# EAGLE design shield_uno (EAGLE 6.5.0)
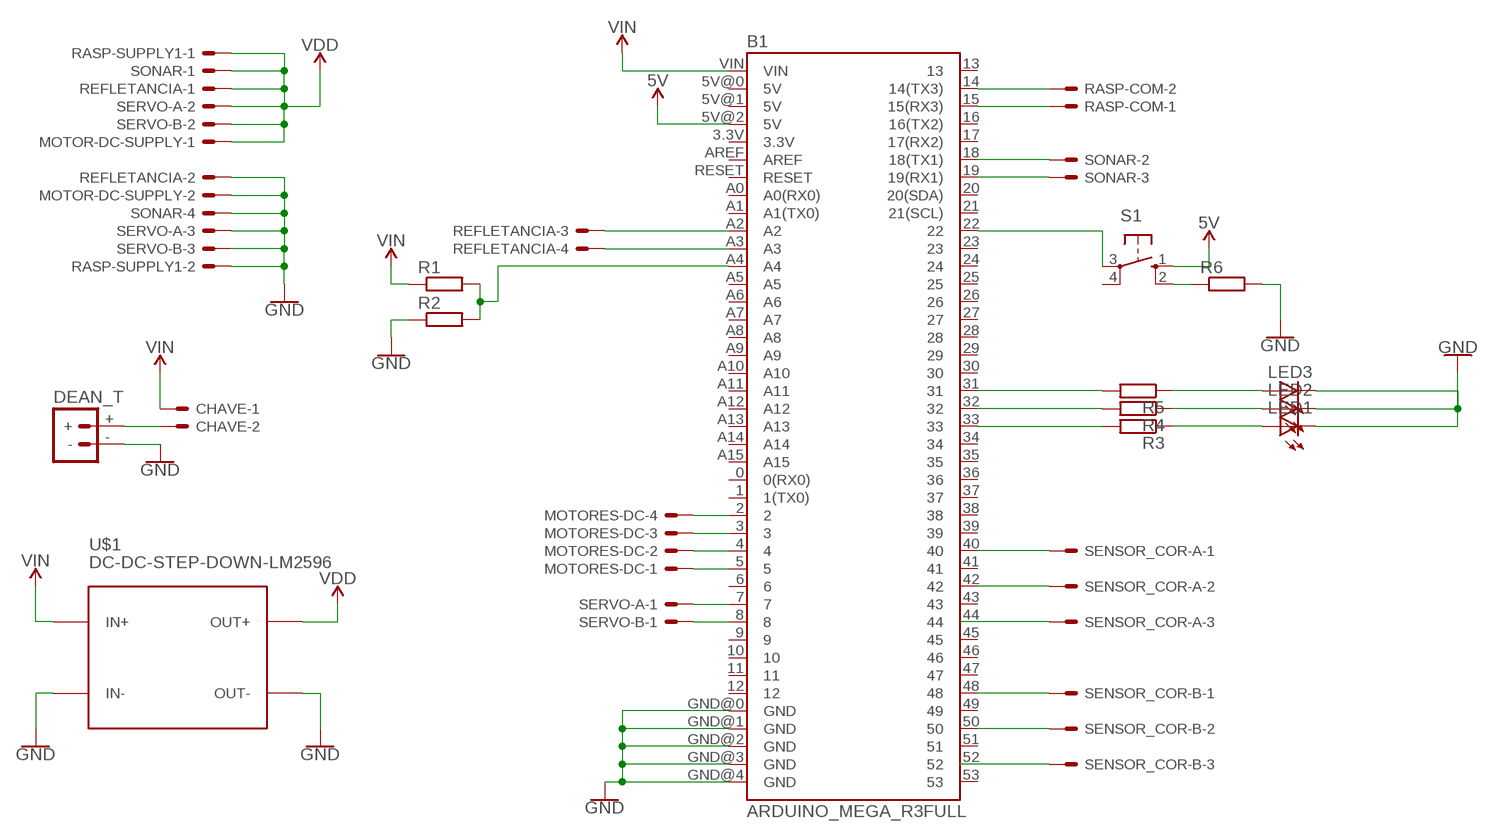
[diagram p0: schematic, sheet 1]

## Parts
B1  ARDUINO_MEGA_R3FULL  [ARDUINO_MEGA]
CHAVE  22-23-2021  [22-23-2021]
DEAN_T  BATTERY_CONN_DEANS  [DEANS]
LED1  LED5MM  [LED5MM]
LED2  LED5MM  [LED5MM]
LED3  LED5MM  [LED5MM]
MOTOR-DC-SUPPLY  22-23-2021  [22-23-2021]
MOTORES-DC  22-23-2041  [22-23-2041]
R1  R-EU_0207/12  [0207/12]
R2  R-EU_0207/12  [0207/12]
R3  R-EU_0207/7  [0207/7]
R4  R-EU_0207/7  [0207/7]
R5  R-EU_0207/7  [0207/7]
R6  R-EU_0204/5  [0204/5]
RASP-COM  22-23-2021  [22-23-2021]
RASP-SUPPLY1  22-23-2021  [22-23-2021]
REFLETANCIA  22-23-2041  [22-23-2041]
S1  10-XX  [B3F-10XX]
SENSOR_COR-A  22-23-2031  [22-23-2031]
SENSOR_COR-B  22-23-2031  [22-23-2031]
SERVO-A  22-23-2031  [22-23-2031]
SERVO-B  22-23-2031  [22-23-2031]
SONAR  22-23-2041  [22-23-2041]
U$1  DC-DC-STEP-DOWN-LM2596  [DC-DC-STEP-DOWN-LM2596]

## Nets
5V: B1.5V@2(5V) S1.1(S)
GND: B1.GND@0(GND) B1.GND@1(GND) B1.GND@2(GND) B1.GND@3(GND) B1.GND@4(GND) DEAN_T.- LED1.K(C) LED2.K(C) LED3.K(C) MOTOR-DC-SUPPLY.2 R2.1 R6.2 RASP-SUPPLY1.2 REFLETANCIA.2 SERVO-A.3 SERVO-B.3 SONAR.4 U$1.IN- U$1.OUT-
N$1: B1.A2 REFLETANCIA.3
N$2: B1.A3 REFLETANCIA.4
N$3: B1.5 MOTORES-DC.1
N$4: B1.4 MOTORES-DC.2
N$5: B1.3 MOTORES-DC.3
N$6: B1.2 MOTORES-DC.4
N$7: B1.8 SERVO-B.1
N$8: B1.7 SERVO-A.1
N$9: B1.14(14(TX3)) RASP-COM.2
N$10: B1.15(15(RX3)) RASP-COM.1
N$11: B1.18(18(TX1)) SONAR.2
N$12: B1.19(19(RX1)) SONAR.3
N$13: CHAVE.2 DEAN_T.+
N$14: B1.40 SENSOR_COR-A.1
N$15: B1.42 SENSOR_COR-A.2
N$16: SENSOR_COR-A.3
N$17: B1.48 SENSOR_COR-B.1
N$18: B1.50 SENSOR_COR-B.2
N$19: SENSOR_COR-B.3
N$20: B1.A4 R1.2 R2.2
N$21: B1.31 R5.2
N$22: B1.32 R4.2
N$23: B1.33 R3.2
N$24: LED1.A R3.1
N$25: LED2.A R4.1
N$26: LED3.A R5.1
N$27: B1.22 S1.3(P)
N$28: R6.1 S1.2(S1)
VDD: MOTOR-DC-SUPPLY.1 RASP-SUPPLY1.1 REFLETANCIA.1 SERVO-A.2 SERVO-B.2 SONAR.1 U$1.OUT+
VIN: B1.VIN CHAVE.1 R1.1 U$1.IN+
Unconnected: B1.0(0(RX0)) B1.1(1(TX0)) B1.3.3V B1.5V@0(5V) B1.5V@1(5V) B1.6 B1.9 B1.10 B1.11 B1.12 B1.13 B1.16(16(TX2)) B1.17(17(RX2)) B1.20(20(SDA)) B1.21(21(SCL)) B1.23 B1.24 B1.25 B1.26 B1.27 B1.28 B1.29 B1.30 B1.34 B1.35 B1.36 B1.37 B1.38 B1.39 B1.41 B1.43 B1.44 B1.45 B1.46 B1.47 B1.49 B1.51 B1.52 B1.53 B1.A0(A0(RX0)) B1.A1(A1(TX0)) B1.A5 B1.A6 B1.A7 B1.A8 B1.A9 B1.A10 B1.A11 B1.A12 B1.A13 B1.A14 B1.A15 B1.AREF B1.RESET S1.4(P1)

## Library data of the parts
B1 = SparkFun-Boards2:ARDUINO_MEGA_R3: Arduino Mega R3 ATmega2560 R3 compatible footprint. SparkFun Products: Arduino Mega 2560 R3 <https://www.sparkfun.com/products/11061>
CHAVE MOTOR-DC-SUPPLY RASP-COM RASP-SUPPLY1 = con-molex:22-23-2021: .100" (2.54mm) Center Header - 2 Pin; MF: MOLEX; MPN: 22-23-2021; OC_FARNELL: 1462926; OC_NEWARK: 25C3832
DEAN_T = SparkFun-Connectors:BATTERY_CONN: Battery Connectors Various footprints for battery connections SparkFun Products: Deans Connector -M/F Pair <https://www.sparkfun.com/products/11864>; SF_ID: PRT-11864
LED1-LED3 = led:LED: LED OSRAM: - CHIPLED LG R971, LG N971, LY N971, LG Q971, LY Q971, LO R971, LY R971 LH N974, LH R974 LS Q976, LO Q976, LY Q976 LO Q996 - Hyper CHIPLED LW Q18S LB Q993, LB Q99A, LB R99A - SideLED LS A670, LO A670, LY A670, LG A670, LP A670 LB A673, LV A673, LT A673, LW A673 LH A674 LY A675 LS A676, LA A676, LO A676, LY A676, LW A676 LS A679, LY A679, LG A679 - Hyper Micro SIDELED® LS Y876, LA Y876, LO Y876, LY Y876 LT Y87S - SmartLED LW L88C, LW L88S LB L89C, LB L89S, LG L890 LS L89K, LO L89K, LY L89K LS L896, LA L896, LO L896, LY L896 - TOPLED LS T670, LO T670, LY T670, LG T670, LP T670 LSG T670, LSP T670, LSY T670, LOP T670, LYG T670 LG T671, LOG T671, LSG T671 LB T673, LV T673, LT T673, LW T673 LH T674 LS T676, LA T676, LO T676, LY T676, LB T676, LH T676, LSB T676, LW T676 LB T67C, LV T67C, LT T67C, LS T67K, LO T67K, LY T67K, LW E67C LS E67B, LA E67B, LO E67B, LY E67B, LB E67C, LV E67C, LT E67C LW T67C LS T679, LY T679, LG T679 LS T770, LO T770, LY T770, LG T770, LP T770 LB T773, LV T773, LT T773, LW T773 LH T774 LS E675, LA E675, LY E675, LS T675 LS T776, LA T776, LO T776, LY T776, LB T776 LHGB T686 LT T68C, LB T68C - Hyper Mini TOPLED® LB M676 - Mini TOPLED Santana® LG M470 LS M47K, LO M47K, LY M47K Source: http://www.osram.convergy.de LUXEON: - LUMILED® LXK2-PW12-R00, LXK2-PW12-S00, LXK2-PW14-U00, LXK2-PW14-V00 LXK2-PM12-R00, LXK2-PM12-S00, LXK2-PM14-U00 LXK2-PE12-Q00, LXK2-PE12-R00, LXK2-PE12-S00, LXK2-PE14-T00, LXK2-PE14-U00 LXK2-PB12-K00, LXK2-PB12-L00, LXK2-PB12-M00, LXK2-PB14-N00, LXK2-PB14-P00, LXK2-PB14-Q00 LXK2-PR12-L00, LXK2-PR12-M00, LXK2-PR14-Q00, LXK2-PR14-R00 LXK2-PD12-Q00, LXK2-PD12-R00, LXK2-PD12-S00 LXK2-PH12-R00, LXK2-PH12-S00 LXK2-PL12-P00, LXK2-PL12-Q00, LXK2-PL12-R00 Source: www.luxeon.com KINGBRIGHT: KA-3528ASYC Source: www.kingbright.com
MOTORES-DC REFLETANCIA SONAR = con-molex:22-23-2041: .100" (2.54mm) Center Header - 4 Pin; MF: MOLEX; MPN: 22-23-2041; OC_FARNELL: 1462920; OC_NEWARK: 38C0355
R1-R6 = rcl:R-EU_: RESISTOR, European symbol
S1 = switch-omron:10-XX: OMRON SWITCH; MPN: B3F-1000; OC_FARNELL: 176432; OC_NEWARK: 36M3542
SENSOR_COR-A SENSOR_COR-B SERVO-A SERVO-B = con-molex:22-23-2031: .100" (2.54mm) Center Header - 3 Pin; MF: MOLEX; MPN: 22-23-2031; OC_FARNELL: 1462950; OC_NEWARK: 30C0862
U$1 = 1484249208697-powermodules:DC-DC-STEP-DOWN-LM2596: DC/DC Step-Down Regulator based on LM2596-ADJ chip

## Board
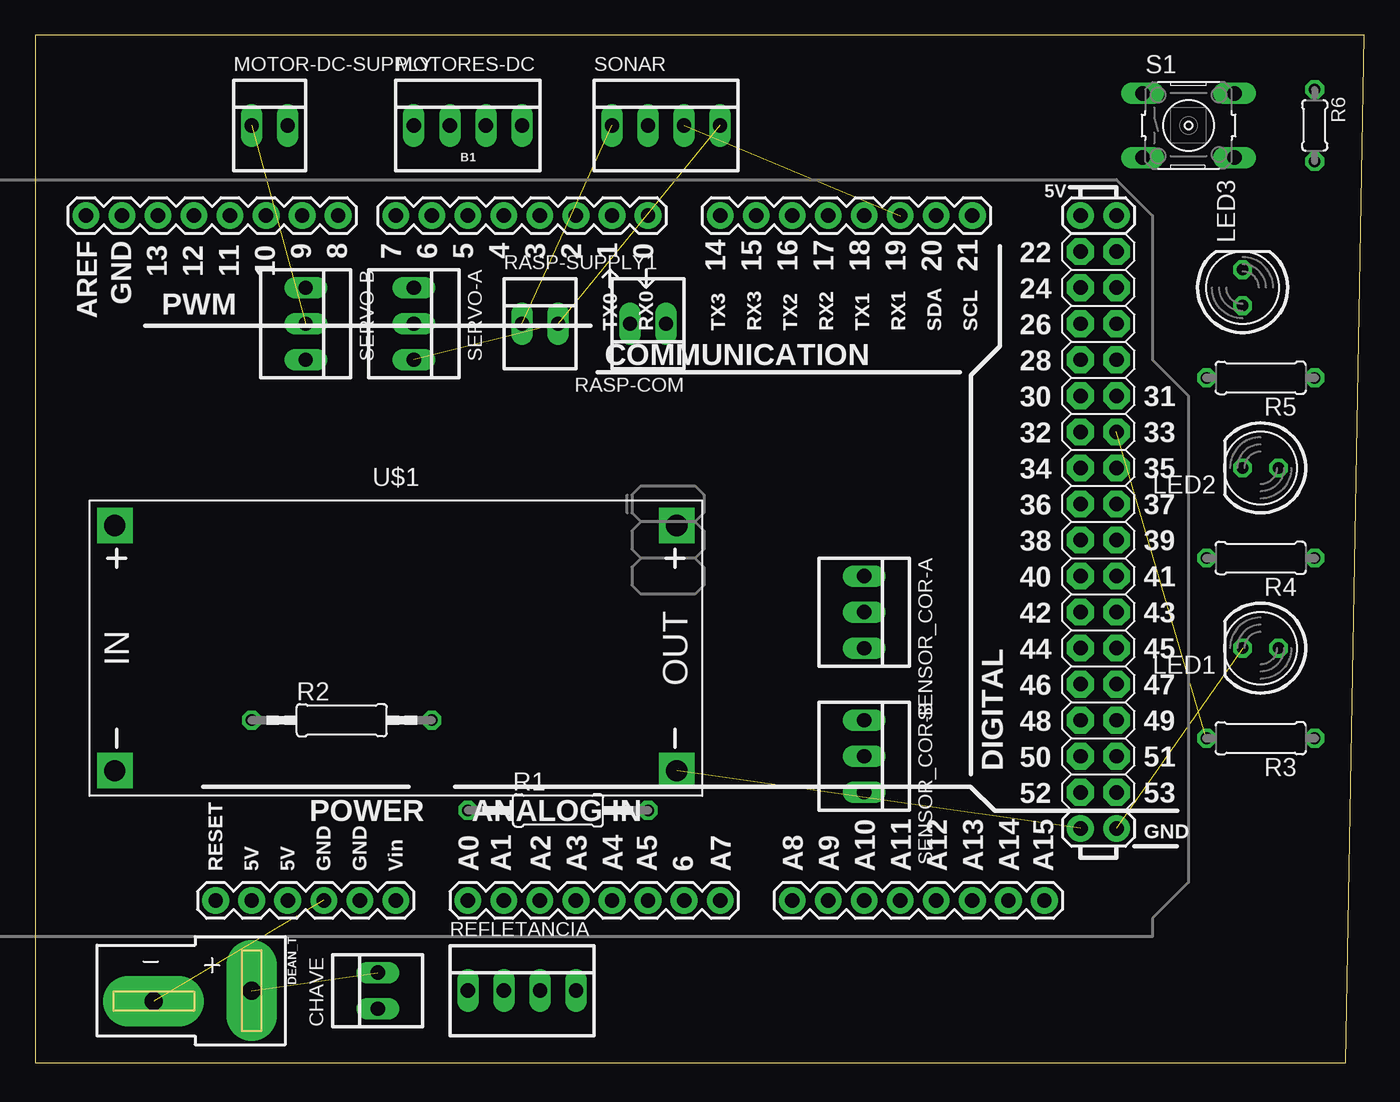
[diagram p1: board, top side]
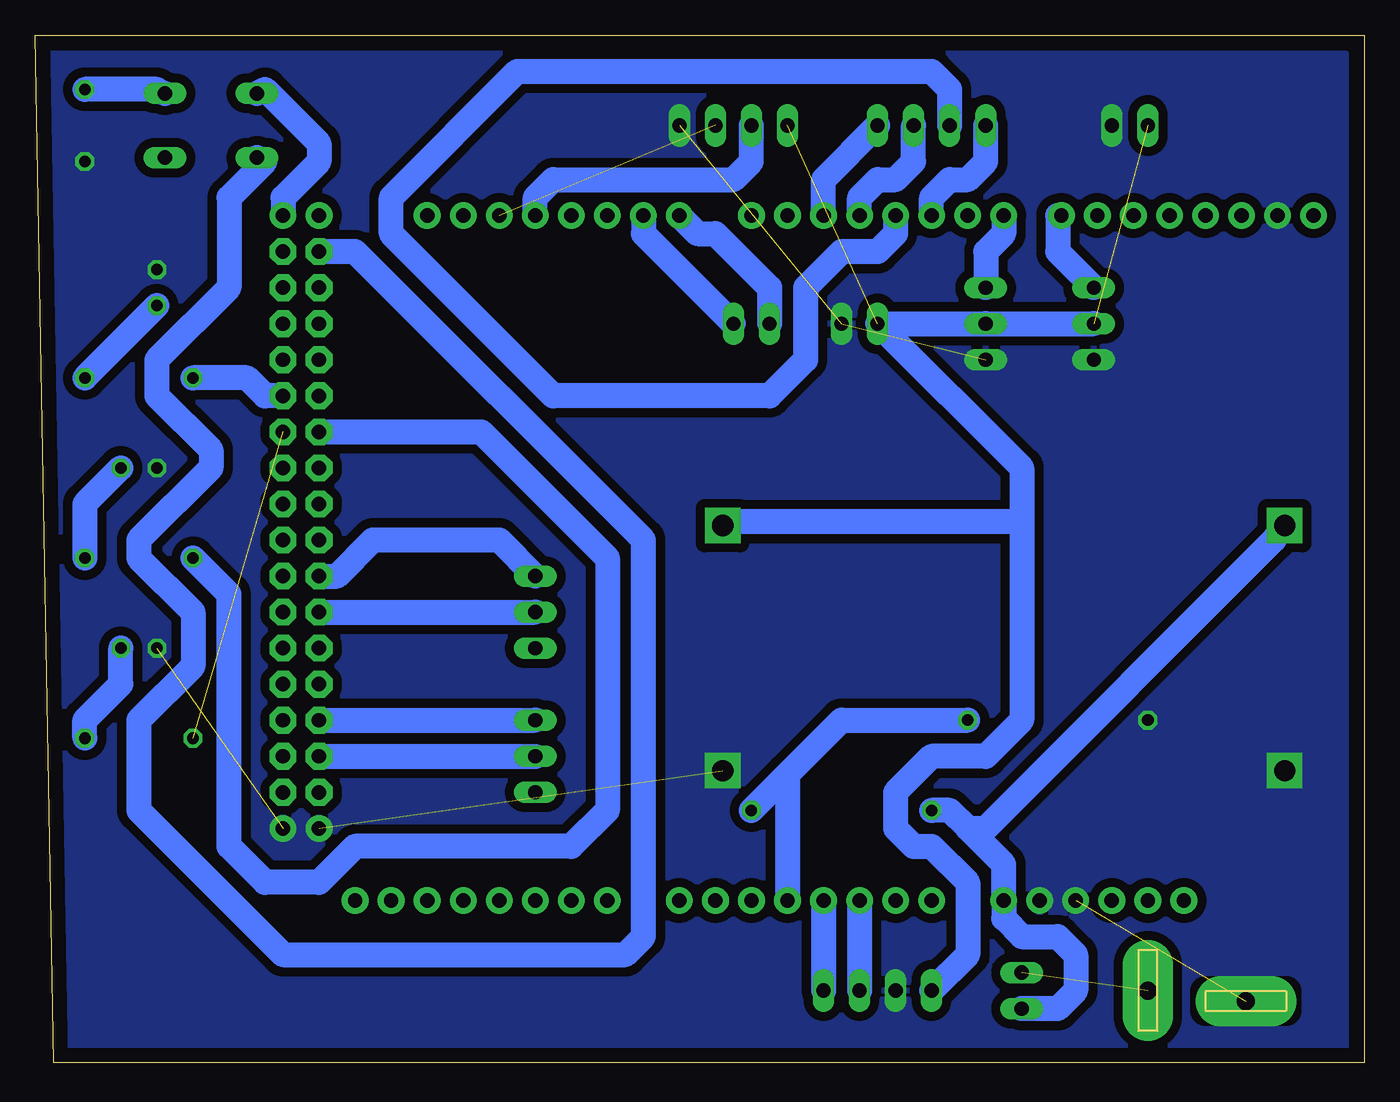
[diagram p2: board, bottom side, seen from below]

Size 93.65 x 72.38 mm. Coordinates in mm from the lower left corner, seen from the top.
Outline: 0,0 92.38,0 93.65,72.38 0,72.38 0,0
Copper layers (1*16): Top 0.035mm / dielectric 1.5mm / Bottom 0.035mm
Design rules "default *": minimum track width 70mil, minimum drill 24mil, track to track 25mil, track to pad 25mil, pad to pad 25mil, via to via 25mil, smd to smd 8mil, copper to edge 40mil, drill to drill 8mil, minimum pad ring 10mil, minimum via ring 8mil, stop-mask expansion 4mil, vias tented up to drill 0mil, thermal gap 0mil

### Footprints (pad centres in the part's own frame; a part is rotated, then mirrored left to right if it is on the bottom)
ARDUINO_MEGA = drill 1.016 pad 1.88: 0 13.97,24.13; 1 11.43,24.13; 2 8.89,24.13; 3 6.35,24.13; 3.3V -13.97,-24.13; 4 3.81,24.13; 5 1.27,24.13; 5V@0 -11.43,-24.13; 5V@1 44.45,24.13; 5V@2 46.99,24.13; 6 -1.27,24.13; 7 -3.81,24.13; 8 -7.874,24.13; 9 -10.414,24.13; 10 -12.954,24.13; 11 -15.494,24.13; 12 -18.034,24.13; 13 -20.574,24.13; 14 19.05,24.13; 15 21.59,24.13; 16 24.13,24.13; 17 26.67,24.13; 18 29.21,24.13; 19 31.75,24.13; 20 34.29,24.13; 21 36.83,24.13; A0 1.27,-24.13; A1 3.81,-24.13; A2 6.35,-24.13; A3 8.89,-24.13; A4 11.43,-24.13; A5 13.97,-24.13; A6 16.51,-24.13; A7 19.05,-24.13; A8 24.13,-24.13; A9 26.67,-24.13; A10 29.21,-24.13; A11 31.75,-24.13; A12 34.29,-24.13; A13 36.83,-24.13; A14 39.37,-24.13; A15 41.91,-24.13; AREF -25.654,24.13; GND@0 -8.89,-24.13; GND@1 -6.35,-24.13; GND@2 44.45,-19.05; GND@3 46.99,-19.05; GND@4 -23.114,24.13; RESET -16.51,-24.13; VIN -3.81,-24.13 | drill 1.016 pad 1.88 octagon: 22 44.45,21.59; 23 46.99,21.59; 24 44.45,19.05; 25 46.99,19.05; 26 44.45,16.51; 27 46.99,16.51; 28 44.45,13.97; 29 46.99,13.97; 30 44.45,11.43; 31 46.99,11.43; 32 44.45,8.89; 33 46.99,8.89; 34 44.45,6.35; 35 46.99,6.35; 36 44.45,3.81; 37 46.99,3.81; 38 44.45,1.27; 39 46.99,1.27; 40 44.45,-1.27; 41 46.99,-1.27; 42 44.45,-3.81; 43 46.99,-3.81; 44 44.45,-6.35; 45 46.99,-6.35; 46 44.45,-8.89; 47 46.99,-8.89; 48 44.45,-11.43; 49 46.99,-11.43; 50 44.45,-13.97; 51 46.99,-13.97; 52 44.45,-16.51; 53 46.99,-16.51
22-23-2021 = drill 1 long: 1 -1.27,0; 2 1.27,0
DEANS = drill 1.27 pad 3.556 long: + 0,0; - 0.737,-6.921
LED5MM = drill 0.813 octagon: A -1.27,0; K 1.27,0
22-23-2041 = drill 1 long: 1 -3.81,0; 2 -1.27,0; 3 1.27,0; 4 3.81,0
0207/12 = drill 0.813 octagon: 1 -6.35,0; 2 6.35,0
0207/7 = drill 0.813 octagon: 1 -3.81,0; 2 3.81,0
0204/5 = drill 0.813 octagon: 1 -2.54,0; 2 2.54,0
B3F-10XX = drill 1.016 long: 1 -3.251,2.261; 2 3.251,2.261; 3 -3.251,-2.261; 4 3.251,-2.261
22-23-2031 = drill 1 long: 1 -2.54,0; 2 0,0; 3 2.54,0
DC-DC-STEP-DOWN-LM2596 = drill 1.5 pad 2.5 square: IN+ -19.812,8.636; IN- -19.812,-8.636; OUT+ 19.812,8.636; OUT- 19.812,-8.636

### Placement (x,y rotation side)
B1  29.21,35.56 0 top
CHAVE  24.13,5.08 90 top
DEAN_T  15.24,5.08 270 top
LED1  86.36,29.21 180 top
LED2  86.36,41.91 180 top
LED3  85.09,54.61 90 top
MOTOR-DC-SUPPLY  16.51,66.04 0 top
MOTORES-DC  30.48,66.04 0 top
R1  36.83,17.78 0 top
R2  21.59,24.13 0 top
R3  86.36,22.86 180 top
R4  86.36,35.56 180 top
R5  86.36,48.26 180 top
R6  90.17,66.04 270 top
RASP-COM  43.18,52.07 180 top
RASP-SUPPLY1  35.56,52.07 0 top
REFLETANCIA  34.29,5.08 0 top
S1  81.28,66.04 0 top
SENSOR_COR-A  58.42,31.75 270 top
SENSOR_COR-B  58.42,21.59 270 top
SERVO-A  26.67,52.07 270 top
SERVO-B  19.05,52.07 270 top
SONAR  44.45,66.04 0 top
U$1  25.4,29.21 0 top

### Tracks (layer width: path | path; a pad name or v marks a point on that pad's centre or on a via)
5V
  Bottom 1.778: B1.5V@2 76.2,60.96 73.66,63.5 73.66,64.77 77.47,68.58 S1.1
GND  (5 unrouted)
  pour Bottom: 1.27,71.12 1.27,0 92.71,0 92.71,71.12
N$1
  Bottom 1.778: B1.A2 REFLETANCIA.3
N$2
  Bottom 1.778: B1.A3 REFLETANCIA.4
N$3
  Bottom 1.778: MOTORES-DC.1 26.67,63.5 27.94,62.23 29.21,62.23 30.48,60.96 B1.5
N$4
  Bottom 1.778: MOTORES-DC.2 29.21,68.58 30.48,69.85 59.69,69.85 68.58,60.96 68.58,58.42 57.15,46.99 41.91,46.99 39.37,49.53 39.37,54.61 36.83,57.15 34.29,57.15 33.02,58.42 B1.4
N$5
  Bottom 1.778: MOTORES-DC.3 31.75,63.5 33.02,62.23 34.29,62.23 35.56,60.96 B1.3
N$6
  Bottom 1.778: MOTORES-DC.4 38.1,62.23 B1.2
N$7
  Bottom 1.778: SERVO-B.1 21.59,57.15 21.59,59.69 B1.8
N$8
  Bottom 1.778: SERVO-A.1 26.67,57.15 25.4,58.42 B1.7
N$9
  Bottom 1.778: RASP-COM.2 41.91,54.61 45.72,58.42 46.99,58.42 B1.14
N$10
  Bottom 1.778: RASP-COM.1 50.8,58.42 B1.15
N$11
  Bottom 1.778: SONAR.2 43.18,63.5 44.45,62.23 57.15,62.23 58.42,60.96 B1.18
N$12  (1 unrouted)
N$13  (1 unrouted)
N$14
  Bottom 1.778: SENSOR_COR-A.1 60.96,36.83 69.85,36.83 72.39,34.29 B1.40
N$15
  Bottom 1.778: B1.42 SENSOR_COR-A.2
N$17
  Bottom 1.778: B1.48 SENSOR_COR-B.1
N$18
  Bottom 1.778: B1.50 SENSOR_COR-B.2
N$20
  Bottom 1.778: R2.2 36.83,24.13 40.64,20.32 | R1.2 40.64,20.32 | 40.64,20.32 B1.A4
N$21
  Bottom 1.778: R5.2 78.74,48.26 77.47,46.99 B1.31
N$22
  Bottom 1.778: R4.2 80.01,33.02 80.01,15.24 77.47,12.7 73.66,12.7 71.12,15.24 55.88,15.24 53.34,17.78 53.34,35.56 62.23,44.45 B1.32
N$23  (1 unrouted)
N$24
  Bottom 1.778: LED1.A 87.63,26.67 90.17,24.13 R3.1
N$25
  Bottom 1.778: R4.1 90.17,39.37 LED2.A
N$26
  Bottom 1.778: LED3.A R5.1
N$27
  Bottom 1.778: B1.22 71.12,57.15 50.8,36.83 50.8,8.89 52.07,7.62 76.2,7.62 86.36,17.78 86.36,24.13 82.55,27.94 82.55,31.75 86.36,35.56 86.36,36.83 81.28,41.91 81.28,43.18 85.09,46.99 85.09,49.53 80.01,54.61 80.01,60.96 77.47,63.5 S1.3
N$28
  Bottom 1.778: R6.1 85.09,68.58 S1.2
VDD  (2 unrouted)
  Bottom 1.778: SERVO-B.2 SERVO-A.2 RASP-SUPPLY1.1 24.13,41.91 24.13,38.1 | REFLETANCIA.1 27.94,7.62 27.94,12.7 30.48,15.24 31.75,15.24 33.02,16.51 33.02,19.05 30.48,21.59 26.67,21.59 24.13,24.13 24.13,38.1 | 24.13,38.1 44.45,38.1 U$1.OUT+
VIN
  Bottom 1.778: R1.1 29.21,17.78 27.94,16.51 | 27.94,16.51 25.4,13.97 B1.VIN 25.4,10.16 24.13,8.89 21.59,8.89 20.32,7.62 20.32,5.08 21.59,3.81 CHAVE.1 | 27.94,16.51 26.67,16.51 6.35,36.83 U$1.IN+